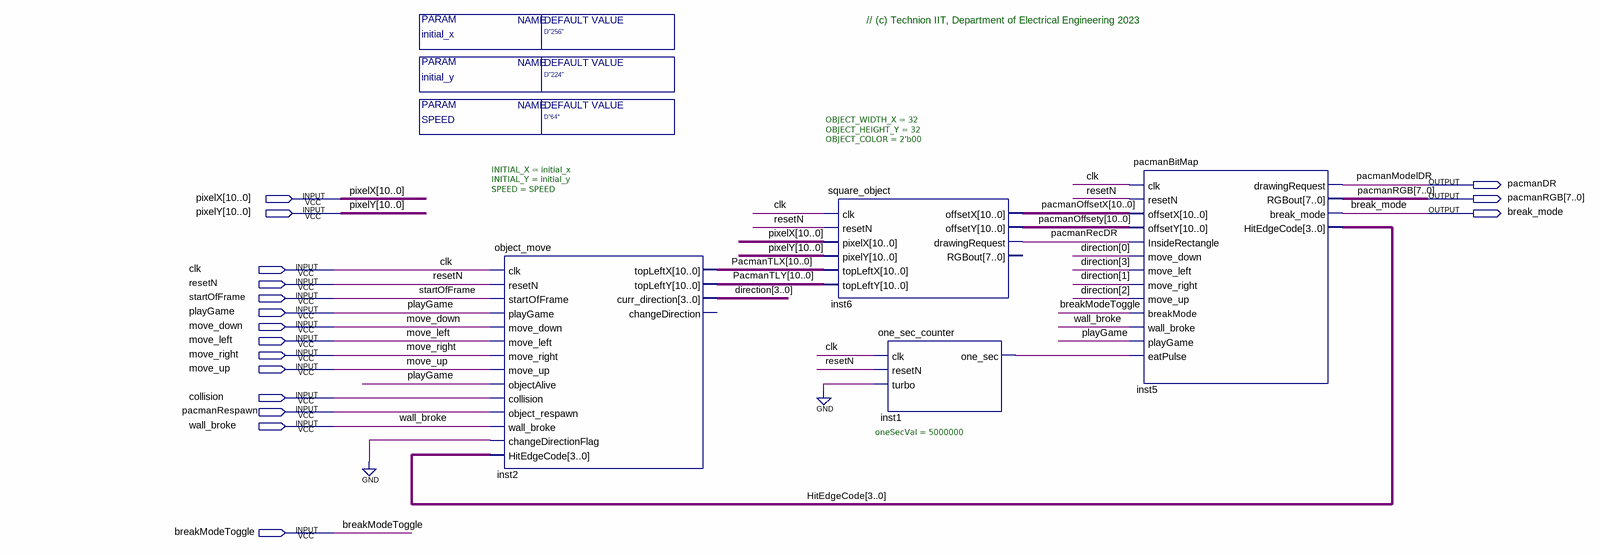
[diagram p0: schematic sheet]
// Quartus schematic Pacman_Block_T.bdf as structural Verilog: 4 symbols, 17 pins
module Pacman_Block_T #(parameter initial_x = "D\"256\"", parameter initial_y = "D\"224\"", parameter SPEED = "D\"64\"") (
  input  [10:0] pixelX,
  input  [10:0] pixelY,
  input  clk,
  input  resetN,
  input  startOfFrame,
  input  playGame,
  input  move_down,
  input  move_left,
  input  move_right,
  input  move_up,
  input  collision,
  input  pacmanRespawn,
  input  wall_broke,
  input  breakModeToggle,
  output pacmanDR,
  output [7:0] pacmanRGB,
  output break_mode
);

  wire inst1_one_sec, pacmanRecDR;
  wire [3:0] direction, HitEdgeCode;
  wire [10:0] pacmanOffsetX, pacmanOffsety, PacmanTLX, PacmanTLY;

  object_move #(.INITIAL_X(initial_x), .INITIAL_Y(initial_y), .SPEED(SPEED)) inst2 (
    .clk(clk), .resetN(resetN), .startOfFrame(startOfFrame), .playGame(playGame), .move_down(move_down),
    .move_left(move_left), .move_right(move_right), .move_up(move_up), .objectAlive(playGame),
    .collision(collision), .object_respawn(pacmanRespawn), .wall_broke(wall_broke),
    .changeDirectionFlag(1'b0), .HitEdgeCode(HitEdgeCode), .topLeftX(PacmanTLX), .topLeftY(PacmanTLY),
    .curr_direction(direction));  // open: changeDirection
  square_object #(.OBJECT_WIDTH_X(32), .OBJECT_HEIGHT_Y(32), .OBJECT_COLOR(2'b00)) inst6 (
    .clk(clk), .resetN(resetN), .pixelX(pixelX), .pixelY(pixelY), .topLeftX(PacmanTLX), .topLeftY(PacmanTLY),
    .offsetX(pacmanOffsetX), .offsetY(pacmanOffsety), .drawingRequest(pacmanRecDR));  // open: RGBout
  one_sec_counter #(.oneSecVal(5000000)) inst1 (.clk(clk), .resetN(resetN), .turbo(1'b0), .one_sec(inst1_one_sec));
  pacmanBitMap inst5 (
    .clk(clk), .resetN(resetN), .offsetX(pacmanOffsetX), .offsetY(pacmanOffsety),
    .InsideRectangle(pacmanRecDR), .move_down(direction[0]), .move_left(direction[3]),
    .move_right(direction[1]), .move_up(direction[2]), .breakMode(breakModeToggle), .wall_broke(wall_broke),
    .playGame(playGame), .eatPulse(inst1_one_sec), .drawingRequest(pacmanDR), .RGBout(pacmanRGB),
    .break_mode(break_mode), .HitEdgeCode(HitEdgeCode));

  // Other names for the same wires on the sheet: pacmanModelDR = pacmanDR

  // Notes on the sheet:
  //   // (c) Technion IIT, Department of Electrical Engineering 2023
endmodule
